# EAGLE design 2-sided_pov (EAGLE 4.13)
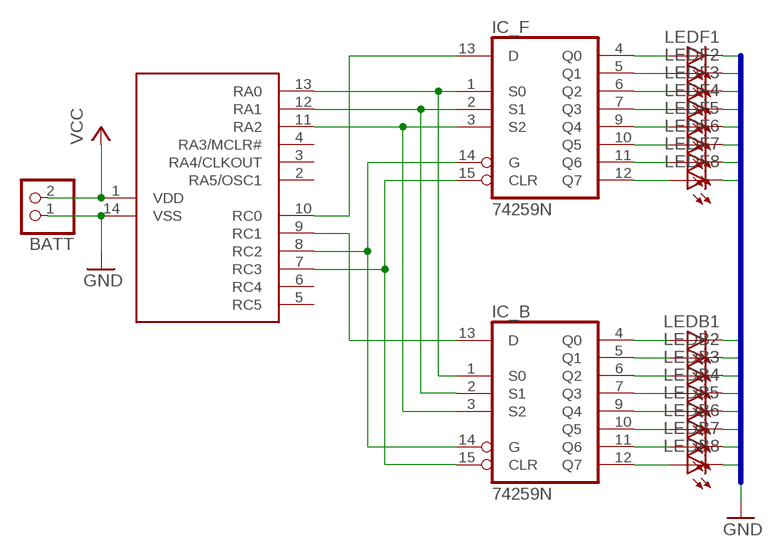
[diagram p0: schematic, sheet 1]

## Parts
BATT  PINHD-1X2  [1X02]
IC3  16F630  [DIL14]
IC_B  74259N  [DIL16]
IC_F  74259N  [DIL16]
LEDB1  LED5MM  [LED5MM]
LEDB2  LED5MM  [LED5MM]
LEDB3  LED5MM  [LED5MM]
LEDB4  LED5MM  [LED5MM]
LEDB5  LED5MM  [LED5MM]
LEDB6  LED5MM  [LED5MM]
LEDB7  LED5MM  [LED5MM]
LEDB8  LED5MM  [LED5MM]
LEDF1  LED5MM  [LED5MM]
LEDF2  LED5MM  [LED5MM]
LEDF3  LED5MM  [LED5MM]
LEDF4  LED5MM  [LED5MM]
LEDF5  LED5MM  [LED5MM]
LEDF6  LED5MM  [LED5MM]
LEDF7  LED5MM  [LED5MM]
LEDF8  LED5MM  [LED5MM]

## Nets
GND: BATT.1 IC3.14(VSS) LEDB1.K(C) LEDB2.K(C) LEDB3.K(C) LEDB4.K(C) LEDB5.K(C) LEDB6.K(C) LEDB7.K(C) LEDB8.K(C) LEDF1.K(C) LEDF2.K(C) LEDF3.K(C) LEDF4.K(C) LEDF5.K(C) LEDF6.K(C) LEDF7.K(C) LEDF8.K(C)
N$1: IC_B.12(Q7) LEDB8.A
N$2: IC_B.11(Q6) LEDB7.A
N$3: IC_B.10(Q5) LEDB6.A
N$4: IC_B.9(Q4) LEDB5.A
N$5: IC_B.7(Q3) LEDB4.A
N$6: IC_B.6(Q2) LEDB3.A
N$7: IC_B.5(Q1) LEDB2.A
N$8: IC_B.4(Q0) LEDB1.A
N$9: IC_F.4(Q0) LEDF1.A
N$10: IC_F.5(Q1) LEDF2.A
N$11: IC_F.6(Q2) LEDF3.A
N$12: IC_F.7(Q3) LEDF4.A
N$13: IC_F.9(Q4) LEDF5.A
N$14: IC_F.10(Q5) LEDF6.A
N$15: IC_F.11(Q6) LEDF7.A
N$16: IC_F.12(Q7) LEDF8.A
N$17: IC3.13(RA0) IC_B.1(S0) IC_F.1(S0)
N$18: IC3.12(RA1) IC_B.2(S1) IC_F.2(S1)
N$19: IC3.11(RA2) IC_B.3(S2) IC_F.3(S2)
N$21: IC3.10(RC0) IC_F.13(D)
N$22: IC3.8(RC2) IC_B.14(G) IC_F.14(G)
N$23: IC3.7(RC3) IC_B.15(CLR) IC_F.15(CLR)
N$25: IC3.9(RC1) IC_B.13(D)
VCC: BATT.2 IC3.1(VDD)
Unconnected: IC3.2(RA5/OSC1) IC3.3(RA4/CLKOUT) IC3.4(RA3/MCLR#) IC3.5(RC5) IC3.6(RC4)

## Buses
GND

## Power pins joined to a net without a drawn wire
GND: IC_B.8(GND) IC_F.8(GND)
VCC: IC_B.16(VCC) IC_F.16(VCC)

## Library data of the parts
BATT = pinhead:PINHD-1X2: PIN HEADER
IC3 = minipov:16F630
IC_B IC_F = 74xx-us:74*259: 8-bit addressable LATCH
LEDB1-LEDB8 LEDF1-LEDF8 = led:LED: LED OSRAM: - CHIPLED LG R971, LG N971, LY N971, LG Q971, LY Q971, LO R971, LY R971 LH N974, LH R974 LS Q976, LO Q976, LY Q976 LO Q996 - Hyper CHIPLED LW Q18S LB Q993, LB Q99A, LB R99A - SideLED LS A670, LO A670, LY A670, LG A670, LP A670 LB A673, LV A673, LT A673, LW A673 LH A674 LY A675 LS A676, LA A676, LO A676, LY A676, LW A676 LS A679, LY A679, LG A679 - Hyper Micro SIDELED® LS Y876, LA Y876, LO Y876, LY Y876 LT Y87S - SmartLED LW L88C, LW L88S LB L89C, LB L89S, LG L890 LS L89K, LO L89K, LY L89K LS L896, LA L896, LO L896, LY L896 - TOPLED LS T670, LO T670, LY T670, LG T670, LP T670 LSG T670, LSP T670, LSY T670, LOP T670, LYG T670 LG T671, LOG T671, LSG T671 LB T673, LV T673, LT T673, LW T673 LH T674 LS T676, LA T676, LO T676, LY T676, LB T676, LH T676, LSB T676, LW T676 LB T67C, LV T67C, LT T67C, LS T67K, LO T67K, LY T67K, LW E67C LS E67B, LA E67B, LO E67B, LY E67B, LB E67C, LV E67C, LT E67C LW T67C LS T679, LY T679, LG T679 LS T770, LO T770, LY T770, LG T770, LP T770 LB T773, LV T773, LT T773, LW T773 LH T774 LS E675, LA E675, LY E675, LS T675 LS T776, LA T776, LO T776, LY T776, LB T776 LHGB T686 LT T68C, LB T68C - Hyper Mini TOPLED® LB M676 - Mini TOPLED Santana® LG M470 LS M47K, LO M47K, LY M47K Source: http://www.osram.convergy.de/

## Board
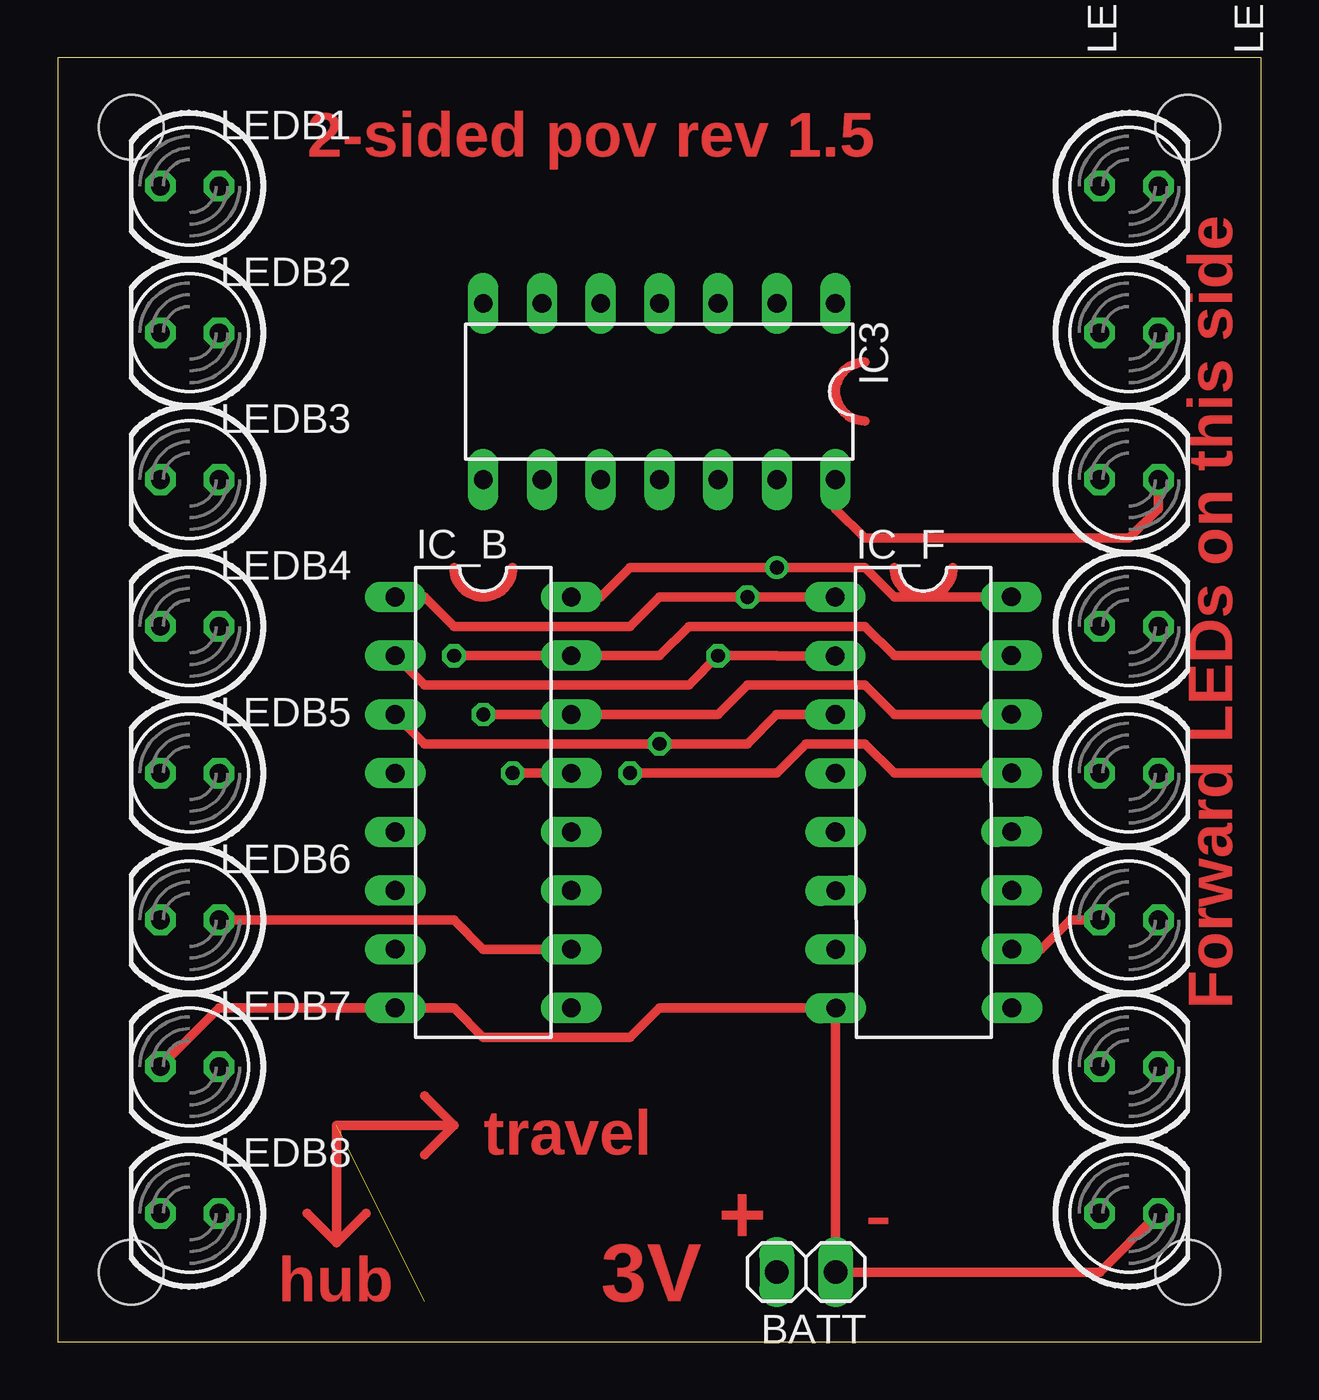
[diagram p1: board, top side]
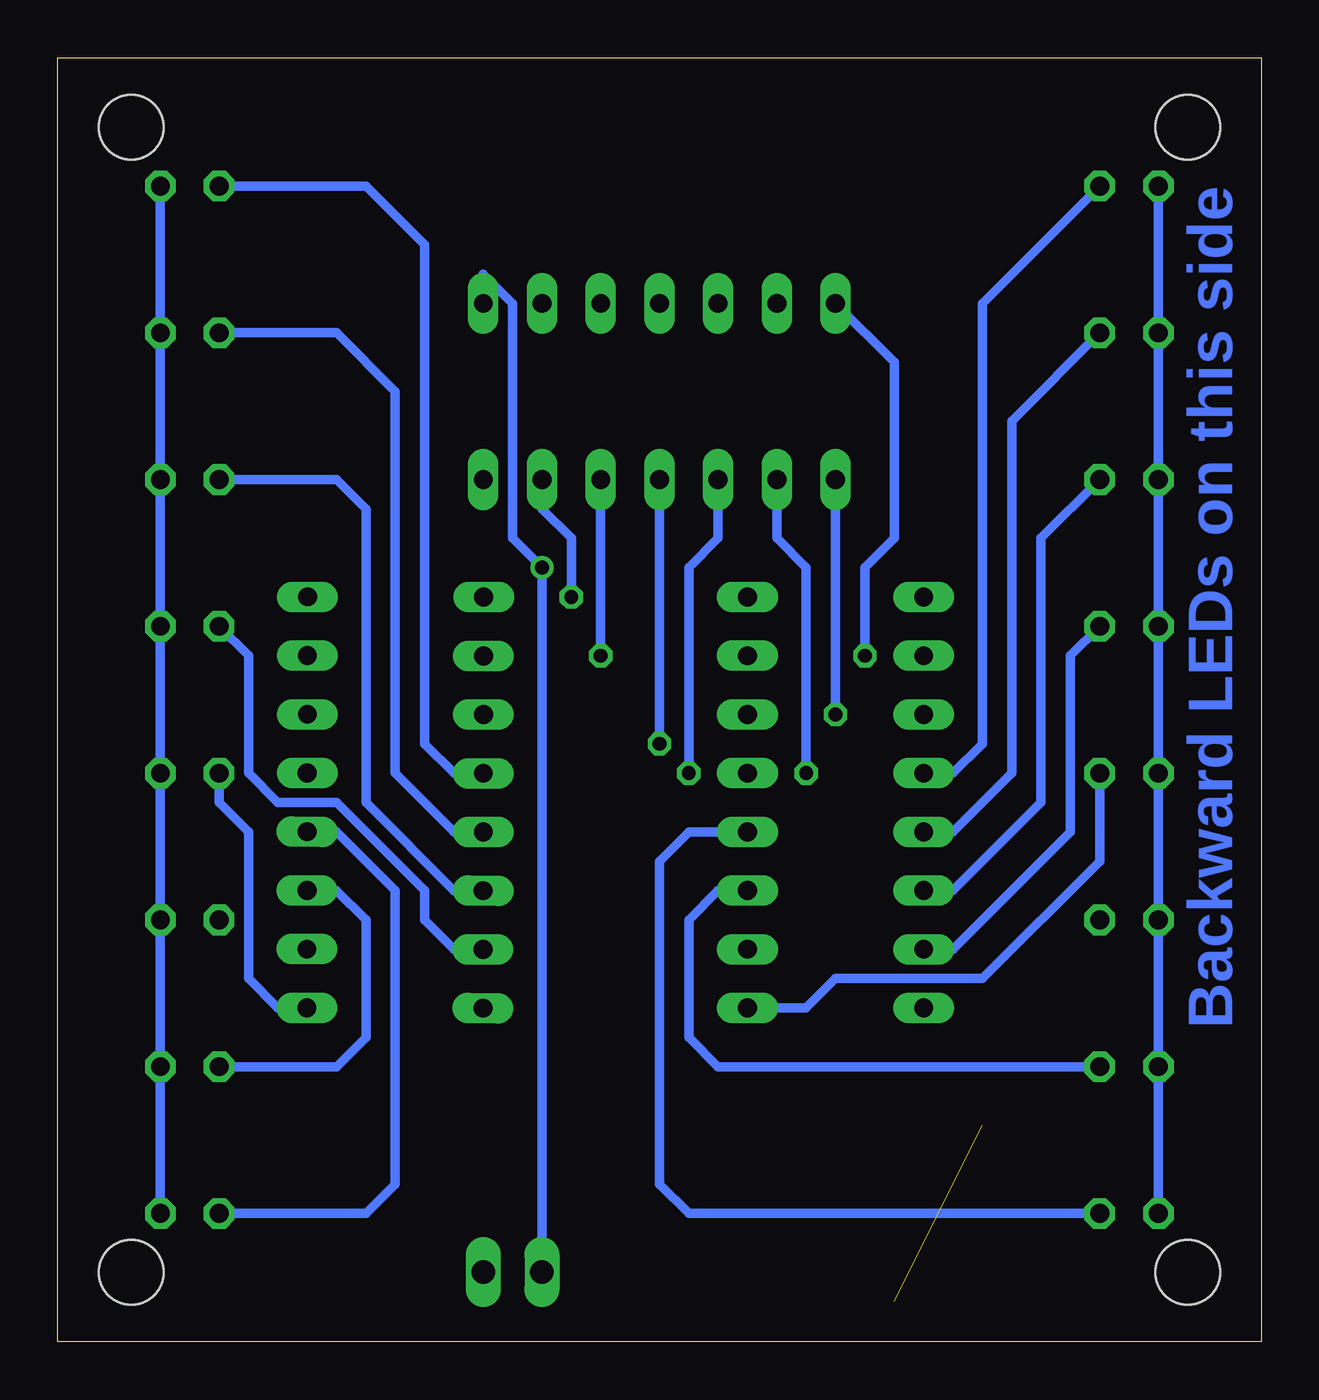
[diagram p2: board, bottom side, seen from below]

Size 52.06 x 55.55 mm. Coordinates in mm from the lower left corner, seen from the top.
Outline: 0,55.55 0,0 52.06,0 52.06,55.55 0,55.55
Copper layers (1*16): Top 0.035mm / dielectric 1.5mm / Bottom 0.035mm
Design rules "default": minimum track width 10mil, minimum drill 24mil, track to track 8mil, track to pad 8mil, pad to pad 8mil, via to via 8mil, smd to smd 8mil, copper to edge 40mil, drill to drill 8mil, minimum pad ring 10mil, minimum via ring 8mil, stop-mask expansion 4mil, vias tented up to drill 0mil, thermal gap 10mil
Holes 2.8 mm at 48.89,52.54 48.89,3.01 3.17,3.01 3.17,52.54

### Footprints (pad centres in the part's own frame; a part is rotated, then mirrored left to right if it is on the bottom)
1X02 = drill 1.016 long: 1 -1.27,0; 2 1.27,0
DIL14 = drill 0.813 long: 1 -7.62,-3.81; 2 -5.08,-3.81; 3 -2.54,-3.81; 4 0,-3.81; 5 2.54,-3.81; 6 5.08,-3.81; 7 7.62,-3.81; 8 7.62,3.81; 9 5.08,3.81; 10 2.54,3.81; 11 0,3.81; 12 -2.54,3.81; 13 -5.08,3.81; 14 -7.62,3.81
DIL16 = drill 0.813 long: 1 -8.89,-3.81; 2 -6.35,-3.81; 3 -3.81,-3.81; 4 -1.27,-3.81; 5 1.27,-3.81; 6 3.81,-3.81; 7 6.35,-3.81; 8 8.89,-3.81; 9 8.89,3.81; 10 6.35,3.81; 11 3.81,3.81; 12 1.27,3.81; 13 -1.27,3.81; 14 -3.81,3.81; 15 -6.35,3.81; 16 -8.89,3.81
LED5MM = drill 0.813 octagon: A -1.27,0; K 1.27,0

### Placement (x,y rotation side)
BATT  32.38,3.01 180 top
IC3  26.03,41.11 180 top
IC_B  18.41,23.33 270 top
IC_F  37.46,23.33 270.1 top
LEDB1  5.71,50 180 top
LEDB2  5.71,43.65 180 top
LEDB3  5.71,37.3 180 top
LEDB4  5.71,30.95 180 top
LEDB5  5.71,24.6 180 top
LEDB6  5.71,18.25 180 top
LEDB7  5.71,11.9 180 top
LEDB8  5.71,5.55 180 top
LEDF1  46.35,50 0 top
LEDF2  46.35,43.65 0 top
LEDF3  46.35,37.3 0 top
LEDF4  46.35,30.95 0 top
LEDF5  46.35,24.6 0 top
LEDF6  46.35,18.25 0 top
LEDF7  46.35,11.9 0 top
LEDF8  46.35,5.55 0 top

### Tracks (layer width: path | path; a pad name or v marks a point on that pad's centre or on a via)
GND
  Top 0.406: LEDB7.K 6.98,14.44 IC_B.8 17.14,14.44 18.41,13.17 24.76,13.17 26.02,14.43 IC_F.8 33.66,14.43 33.65,14.44 BATT.1 45.08,3.01 LEDF8.K | IC3.14 33.65,36.03 34.92,34.76 46.35,34.76 47.62,36.03 LEDF3.K
  Bottom 0.406: LEDB8.K LEDB7.K LEDB6.K LEDB5.K LEDB4.K LEDB3.K LEDB2.K LEDB1.K | LEDF1.K LEDF2.K LEDF3.K LEDF4.K LEDF5.K LEDF6.K LEDF7.K | LEDF8.K LEDF7.K | LEDF7.K 47.62,9.36
N$1
  Bottom 0.406: IC_B.12 24.76,22.06 26.03,20.79 26.03,6.82 24.76,5.55 LEDB8.A
N$2
  Bottom 0.406: IC_B.11 23.49,19.52 24.76,18.25 24.76,13.17 23.49,11.9 LEDB7.A
N$3
  Top 0.406: IC_B.10 18.41,16.98 17.14,18.25 LEDB6.A
N$4
  Bottom 0.406: IC_B.9 19.68,14.44 18.41,15.71 12.06,15.71 6.98,20.79 LEDB5.A
N$5
  Bottom 0.406: IC_B.7 13.33,16.98 8.25,22.06 8.25,29.68 LEDB4.A
N$6
  Bottom 0.406: IC_B.6 13.33,19.52 9.52,23.33 9.52,34.76 LEDB3.A
N$7
  Bottom 0.406: IC_B.5 13.33,22.06 10.79,24.6 10.79,39.84 LEDB2.A
N$8
  Bottom 0.406: IC_B.4 13.33,24.6 12.06,25.87 12.06,44.92 LEDB1.A
N$9
  Bottom 0.406: IC_F.4 34.92,24.6 36.19,25.87 36.19,47.46 38.73,50 LEDF1.A
N$10
  Bottom 0.406: IC_F.5 34.92,22.06 37.46,24.6 37.46,41.11 40,43.65 LEDF2.A
N$11
  Bottom 0.406: IC_F.6 34.91,19.51 38.73,23.33 38.73,36.03 40,37.3 LEDF3.A
N$12
  Bottom 0.406: IC_F.7 33.64,16.97 34.92,16.98 36.19,18.25 36.19,19.52 40,23.33 42.54,23.33 43.81,24.6 43.81,29.68 LEDF4.A
N$13
  Bottom 0.406: IC_F.9 41.28,14.45 41.27,14.44 42.54,14.44 43.81,15.71 43.81,22.06 45.08,23.33 LEDF5.A
N$14
  Top 0.406: LEDF6.A 43.81,18.25 42.54,16.98 IC_F.10
N$15
  Bottom 0.406: IC_F.11 40.01,19.53 38.73,18.25 38.73,13.17 40,11.9 LEDF7.A
N$16
  Bottom 0.406: IC_F.12 40.01,22.07 37.46,19.52 37.46,6.82 38.73,5.55 LEDF8.A
N$17  (via drill 0.6)
  Top 0.406: IC_F.1 32.37,32.21 32.38,32.22 v29.84,32.22 26.03,32.22 24.76,30.95 17.14,30.95 15.87,32.22 IC_B.1
  Bottom 0.406: IC3.13 31.11,36.03 29.84,34.76 v29.84,32.22
N$18  (via drill 0.6)
  Top 0.406: IC_F.2 31.12,29.67 31.11,29.68 v28.57,29.68 27.3,28.41 15.87,28.41 IC_B.2
  Bottom 0.406: v28.57,29.68 IC3.12
N$19  (via drill 0.6)
  Top 0.406: IC_B.3 15.87,25.87 v26.03,25.87 29.84,25.87 31.1,27.13 IC_F.3
  Bottom 0.406: v26.03,25.87 IC3.11
N$21  (via drill 0.6)
  Top 0.406: IC_F.13 36.2,24.61 36.19,24.6 34.92,25.87 32.38,25.87 31.11,24.6 v24.76,24.6
  Bottom 0.406: v24.76,24.6 24.76,33.49 23.49,34.76 IC3.10
N$22  (via drill 0.6)
  Top 0.406: IC_F.14 36.19,27.14 34.92,28.41 29.84,28.41 28.57,27.14 IC_B.14 v18.41,27.14
  Bottom 0.406: v18.41,27.14 IC3.8
N$23  (via drill 0.6)
  Top 0.406: v17.14,29.68 IC_B.15 26.03,29.68 27.3,30.95 34.92,30.95 36.19,29.68 IC_F.15
  Bottom 0.406: v17.14,29.68 17.14,33.49 15.87,34.76 15.87,42.38 IC3.7
N$25  (via drill 0.6)
  Top 0.406: v19.68,24.6 IC_B.13
  Bottom 0.406: IC3.9 20.95,34.76 19.68,33.49 v19.68,24.6
N$26
  Top 0.406: 17.14,33.49 arc180 19.68,33.49
N$27
  Top 0.406: 36.19,33.49 arc180 38.73,33.49
N$28
  Top 0.406: 34.92,42.38 arc180 34.92,39.84
N$29  (1 unrouted)
N$30
  Top 0.406: 12.06,4.28 12.06,9.36 17.14,9.36 | 15.87,10.63 17.14,9.36 | 17.14,9.36 15.87,8.09 | 13.33,5.55 12.06,4.28 | 10.79,5.55 12.06,4.28
VCC  (via drill 0.6)
  Top 0.406: IC_F.16 36.2,32.23 36.19,32.22 34.92,33.49 v31.11,33.49 24.76,33.49 23.49,32.22 IC_B.16
  Bottom 0.406: IC3.1 33.65,46.19 32.38,44.92 32.38,34.76 v31.11,33.49 BATT.2

### Text on the board
Top: 2-sided pov rev 1.5 | Forward LEDs on this side | travel | + | - | hub | 3V
Bottom: Backward LEDs on this side